# EAGLE design TinyCube12a_Lib (EAGLE 7.5.0)
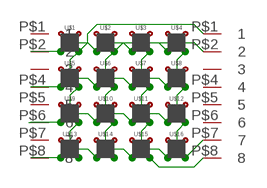
[diagram p0: schematic, sheet 1]

## Parts
U$1  PILLAR  [10MIL]
U$2  PILLAR  [10MIL]
U$3  PILLAR  [10MIL]
U$4  PILLAR  [10MIL]
U$5  PILLAR  [10MIL]
U$6  PILLAR  [10MIL]
U$7  PILLAR  [10MIL]
U$8  PILLAR  [10MIL]
U$9  PILLAR  [10MIL]
U$10  PILLAR  [10MIL]
U$11  PILLAR  [10MIL]
U$12  PILLAR  [10MIL]
U$13  PILLAR  [10MIL]
U$14  PILLAR  [10MIL]
U$15  PILLAR  [10MIL]
U$16  PILLAR  [10MIL]
U$17  TINY_HEADER_DEV  [TINY_HEADER_PKG]
U$18  TINY_HEADER_DEV  [TINY_HEADER_PKG]

## Nets
N$2: U$5.G(A) U$6.G(A) U$7.G(A) U$8.G(A) U$17.P$4
N$3: U$9.G(A) U$10.G(A) U$11.G(A) U$12.G(A) U$17.P$6
N$4: U$13.G(A) U$14.G(A) U$15.G(A) U$16.G(A) U$17.P$8
N$5: U$1.B(R) U$5.B(R) U$9.B(R) U$13.B(R) U$18.P$1
N$6: U$4.B(R) U$8.B(R) U$12.B(R) U$16.B(R) U$18.P$7
N$7: U$3.B(R) U$7.B(R) U$11.B(R) U$15.B(R) U$18.P$8
N$8: U$2.B(R) U$6.B(R) U$10.B(R) U$14.B(R) U$18.P$2
N$9: U$1.G(A) U$2.G(A) U$3.G(A) U$4.G(A) U$17.P$2
Unconnected: U$1.+(G) U$1.R(B) U$2.+(G) U$2.R(B) U$3.+(G) U$3.R(B) U$4.+(G) U$4.R(B) U$5.+(G) U$5.R(B) U$6.+(G) U$6.R(B) U$7.+(G) U$7.R(B) U$8.+(G) U$8.R(B) U$9.+(G) U$9.R(B) U$10.+(G) U$10.R(B) U$11.+(G) U$11.R(B) U$12.+(G) U$12.R(B) U$13.+(G) U$13.R(B) U$14.+(G) U$14.R(B) U$15.+(G) U$15.R(B) U$16.+(G) U$16.R(B) U$17.P$1 U$17.P$3 U$17.P$5 U$17.P$7 U$18.P$3 U$18.P$4 U$18.P$5 U$18.P$6

## Library data of the parts
U$1-U$16 = PILLAR:PILLAR
U$17 U$18 = TinyHeader:TINY_HEADER_DEV

## Board
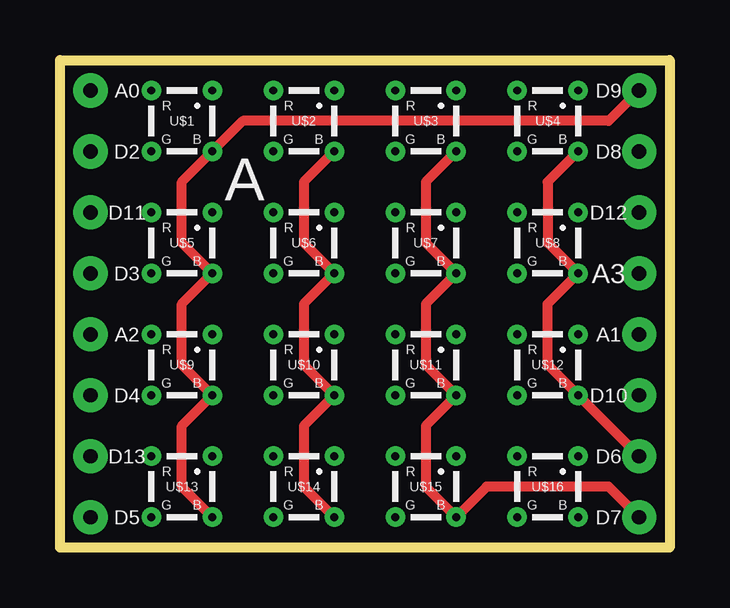
[diagram p1: board, top side]
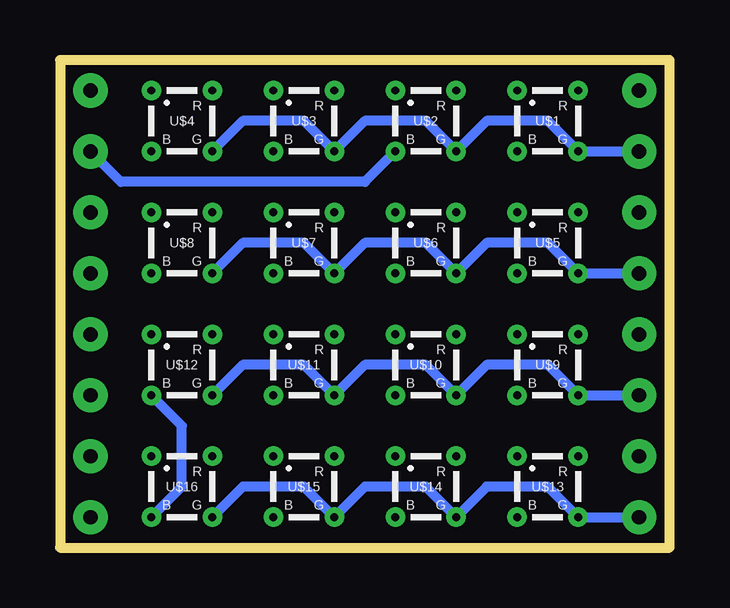
[diagram p2: board, bottom side, seen from below]

Size 25.4 x 20.32 mm. Coordinates in mm from the lower left corner, seen from the top.
Outline: 0,0 0,20.32 25.4,20.32 25.4,0 0,0
Copper layers (1*16): Top 0.0356mm / dielectric 1.5011mm / Bottom 0.0356mm
Design rules "LaenPCBOrder": minimum track width 6mil, minimum drill 13mil, track to track 6mil, track to pad 6mil, pad to pad 6mil, via to via 6mil, smd to smd 6mil, copper to edge 15mil, drill to drill 6mil, minimum pad ring 7mil, minimum via ring 7mil, stop-mask expansion 3mil, vias tented up to drill 0mil, thermal gap 10mil

### Footprints (pad centres in the part's own frame; a part is rotated, then mirrored left to right if it is on the bottom)
10MIL = drill 0.33 pad 0.813: + 1.27,1.27; B 1.27,-1.27; G -1.27,-1.27; R -1.27,1.27
TINY_HEADER_PKG = drill 0.6 pad 1.422: P$1 0,0; P$2 0,-2.54; P$3 0,-5.08; P$4 0,-7.62; P$5 0,-10.16; P$6 0,-12.7; P$7 0,-15.24; P$8 0,-17.78

### Placement (x,y rotation side)
U$1  5.08,17.78 0 top
U$2  10.16,17.78 0 top
U$3  15.24,17.78 0 top
U$4  20.32,17.78 0 top
U$5  5.08,12.7 0 top
U$6  10.16,12.7 0 top
U$7  15.24,12.7 0 top
U$8  20.32,12.7 0 top
U$9  5.08,7.62 0 top
U$10  10.16,7.62 0 top
U$11  15.24,7.62 0 top
U$12  20.32,7.62 0 top
U$13  5.08,2.54 0 top
U$14  10.16,2.54 0 top
U$15  15.24,2.54 0 top
U$16  20.32,2.54 0 top
U$17  1.27,19.05 0 top
U$18  24.13,19.05 0 top

### Tracks (layer width: path | path; a pad name or v marks a point on that pad's centre or on a via)
N$2
  Bottom 0.406: U$8.G 17.78,12.7 15.24,12.7 U$7.G 12.7,12.7 10.16,12.7 U$6.G 7.62,12.7 5.08,12.7 U$5.G U$17.P$4
N$3
  Bottom 0.406: U$12.G 17.78,7.62 15.24,7.62 U$11.G 12.7,7.62 10.16,7.62 U$10.G 7.62,7.62 5.08,7.62 U$9.G U$17.P$6
N$4
  Bottom 0.406: U$16.G 17.78,2.54 15.24,2.54 U$15.G 12.7,2.54 10.16,2.54 U$14.G 7.62,2.54 5.08,2.54 U$13.G U$17.P$8
N$5
  Top 0.406: U$13.B 5.08,2.54 5.08,5.08 U$9.B 5.08,7.62 5.08,10.16 U$5.B 5.08,12.7 5.08,15.24 U$1.B 7.62,17.78 22.86,17.78 U$18.P$1
N$6
  Top 0.406: U$4.B 20.32,15.24 20.32,12.7 U$8.B 20.32,10.16 20.32,7.62 U$12.B U$18.P$7
  Bottom 0.406: U$16.B 20.32,2.54 20.32,5.08 U$12.B
N$7
  Top 0.406: U$3.B 15.24,15.24 15.24,12.7 U$7.B 15.24,10.16 15.24,7.62 U$11.B 15.24,5.08 15.24,2.54 U$15.B 17.78,2.54 22.86,2.54 U$18.P$8
N$8
  Top 0.406: U$2.B 10.16,15.24 10.16,12.7 U$6.B 10.16,10.16 10.16,7.62 U$10.B 10.16,5.08 10.16,2.54 U$14.B
  Bottom 0.406: U$2.B 12.7,15.24 22.86,15.24 U$18.P$2
N$9
  Bottom 0.406: U$4.G 17.78,17.78 15.24,17.78 U$3.G 12.7,17.78 10.16,17.78 U$2.G 7.62,17.78 5.08,17.78 U$1.G U$17.P$2

### Text on the board
tNames: A0 | D9 | D2 | D8 | D11 | A | D12 | D3 | A3 | A2 | A1 | D4 | D10 | D13 | D6 | D5 | D7